# Altium schematic sheet 06_TF_CARD.SchDoc
size A4
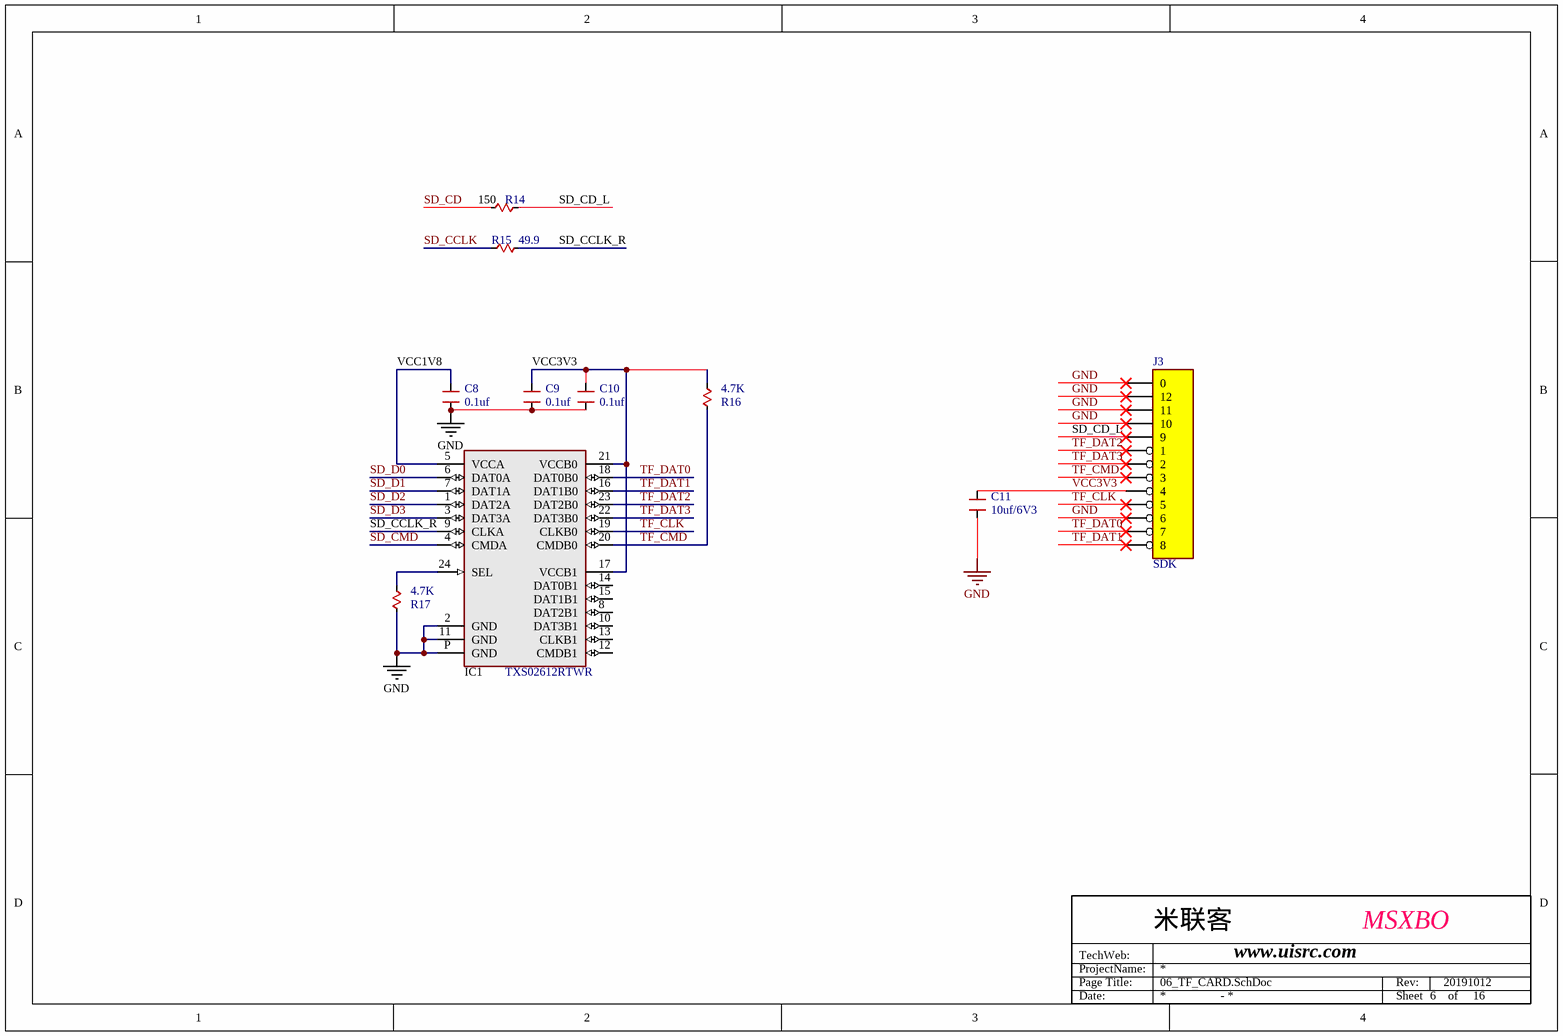
[diagram p0: 06_TF_CARD.SchDoc]

## Parts
C8  0.1uf  [CAP0603]
C9  0.1uf  [CAP0603]
C10  0.1uf  [CAP0603]
C11  10uf/6V3  [CAP0603]
IC1  TXS02612RTWR  [QFN24]
J3  SDK  [TF_K]
R14  value 150  [R0603]  (hidden comment: 150R)
R15  49.9  [R0603]
R16  4.7K  [R0603]
R17  4.7K  [R0603]

## Nets
GND: C8.2 C9.2 C10.2 C11.2 IC1.2(GND) IC1.11(GND) IC1.P(GND) J3.0 J3.6 J3.10 J3.11 J3.12 R17.1
SD_CCLK: R15.2
SD_CCLK_R: IC1.9(CLKA) R15.1
SD_CD: R14.1
SD_CD_L: J3.9 R14.2
SD_CMD: IC1.4(CMDA)
SD_D0: IC1.6(DAT0A)
SD_D1: IC1.7(DAT1A)
SD_D2: IC1.1(DAT2A)
SD_D3: IC1.3(DAT3A)
TF_CLK: IC1.19(CLKB0) J3.5
TF_CMD: IC1.20(CMDB0) J3.3 R16.1
TF_DAT0: IC1.18(DAT0B0) J3.7
TF_DAT1: IC1.16(DAT1B0) J3.8
TF_DAT2: IC1.23(DAT2B0) J3.1
TF_DAT3: IC1.22(DAT3B0) J3.2
VCC1V8: C8.1 IC1.5(VCCA)
VCC3V3: C9.1 C10.1 C11.1 IC1.17(VCCB1) IC1.21(VCCB0) J3.4 R16.2
NetIC1_24: IC1.24(SEL) R17.2

Not connected (* = marked no-connect by the designer): IC1 8(DAT2B1) 10(DAT3B1) 12(CMDB1) 13(CLKB1) 14(DAT0B1) 15(DAT1B1)

## Notes on the sheet
- ProjectName:
- TechWeb:
- Page Title:
- 米联客
- www.uisrc.com
- MSXBO
- Rev:
- 20191012
- Date:
- -
- Sheet
- 6    of     16

## Library data of the parts
C8-C10 = CAPACITOR: Generic Capacitor; DPN: *; Manufacturer: *; Value: 0.1uF
C11 = CAPACITOR: Generic Capacitor; Value: 4.7uF; DPN: *; Manufacturer: *
IC1 = TXS02612: SDIO Port Expander with Voltage-Level Translation; Manufacturer: Texas Instruments; DPN: *
J3 = SD
R14 R16 R17 = RESISTOR: Generic Resistor; Manufacturer: *; DPN: *
  R16 R17: Value: 4.7K
R15 = RESISTOR: LoadStatus: Load; Manufacturer: *; DPN: *; Value: 49.9